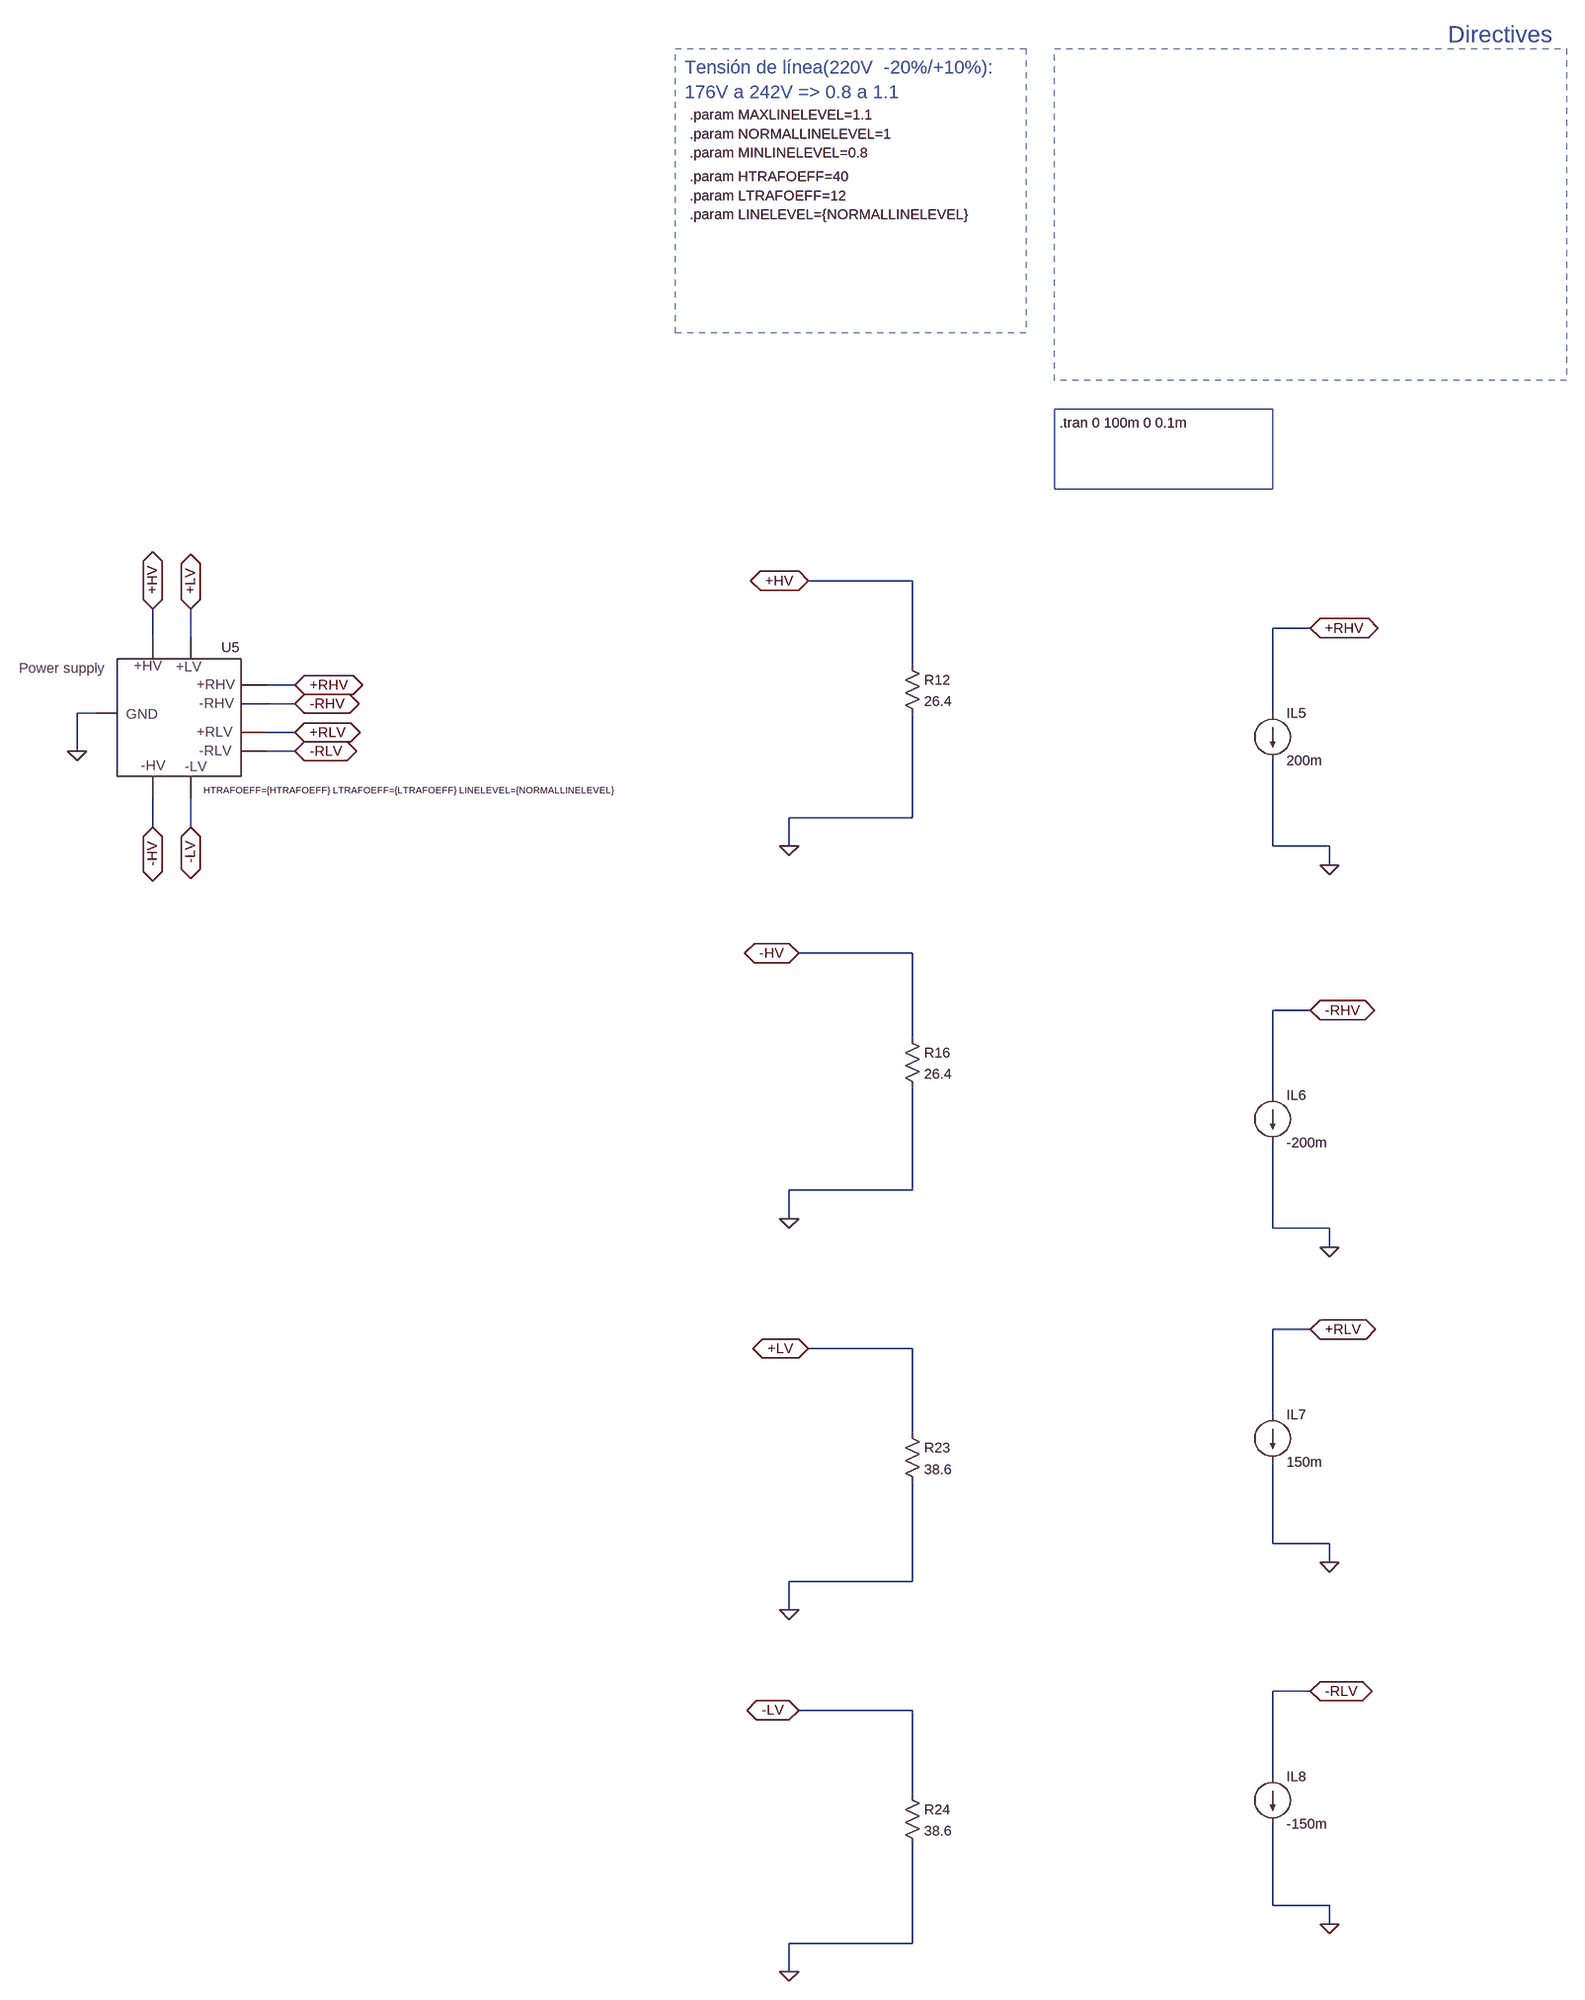
[diagram p0: schematic power_supply_V_1.0.asc]
power_supply_V_1.0.asc, the LTspice schematic file:
Version 4
SHEET 1 5728 3316
WIRE 3584 -688 3408 -688
WIRE 4256 -608 4192 -608
WIRE 1920 -592 1920 -640
WIRE 1984 -592 1984 -640
WIRE 3584 -544 3584 -688
WIRE 2160 -512 2112 -512
WIRE 2160 -480 2112 -480
WIRE 1824 -464 1792 -464
WIRE 4192 -464 4192 -608
WIRE 2160 -432 2112 -432
WIRE 1792 -400 1792 -464
WIRE 2160 -400 2112 -400
WIRE 3584 -288 3584 -464
WIRE 3584 -288 3376 -288
WIRE 1920 -272 1920 -320
WIRE 1984 -272 1984 -320
WIRE 3376 -240 3376 -288
WIRE 4192 -240 4192 -384
WIRE 4288 -240 4192 -240
WIRE 4288 -208 4288 -240
WIRE 3584 16 3392 16
WIRE 4256 112 4192 112
WIRE 3584 160 3584 16
WIRE 4192 256 4192 112
WIRE 3584 416 3584 240
WIRE 3584 416 3376 416
WIRE 3376 464 3376 416
WIRE 4192 480 4192 336
WIRE 4288 480 4192 480
WIRE 4288 512 4288 480
WIRE 4256 816 4192 816
WIRE 3584 848 3408 848
WIRE 4192 960 4192 816
WIRE 3584 992 3584 848
WIRE 4192 1184 4192 1040
WIRE 4288 1184 4192 1184
WIRE 4288 1216 4288 1184
WIRE 3584 1248 3584 1072
WIRE 3584 1248 3376 1248
WIRE 3376 1296 3376 1248
WIRE 4256 1520 4192 1520
WIRE 3584 1552 3392 1552
WIRE 4192 1664 4192 1520
WIRE 3584 1696 3584 1552
WIRE 4192 1888 4192 1744
WIRE 4288 1888 4192 1888
WIRE 4288 1920 4288 1888
WIRE 3584 1952 3584 1776
WIRE 3584 1952 3376 1952
WIRE 3376 2000 3376 1952
FLAG 3408 -688 +HV
IOPIN 3408 -688 BiDir
FLAG 3376 -240 0
FLAG 3392 16 -HV
IOPIN 3392 16 BiDir
FLAG 3376 464 0
FLAG 4256 -608 +RHV
IOPIN 4256 -608 BiDir
FLAG 4288 -208 0
FLAG 4256 112 -RHV
IOPIN 4256 112 BiDir
FLAG 4288 512 0
FLAG 4256 816 +RLV
IOPIN 4256 816 BiDir
FLAG 4288 1216 0
FLAG 4256 1520 -RLV
IOPIN 4256 1520 BiDir
FLAG 4288 1920 0
FLAG 3408 848 +LV
IOPIN 3408 848 BiDir
FLAG 3376 1296 0
FLAG 3392 1552 -LV
IOPIN 3392 1552 BiDir
FLAG 3376 2000 0
FLAG 1792 -400 0
FLAG 1920 -640 +HV
IOPIN 1920 -640 BiDir
FLAG 1984 -640 +LV
IOPIN 1984 -640 BiDir
FLAG 1920 -272 -HV
IOPIN 1920 -272 BiDir
FLAG 1984 -272 -LV
IOPIN 1984 -272 BiDir
FLAG 2160 -512 +RHV
IOPIN 2160 -512 BiDir
FLAG 2160 -480 -RHV
IOPIN 2160 -480 BiDir
FLAG 2160 -432 +RLV
IOPIN 2160 -432 BiDir
FLAG 2160 -400 -RLV
IOPIN 2160 -400 BiDir
SYMBOL current 4192 -464 R0
WINDOW 123 0 0 Left 0
WINDOW 39 0 0 Left 0
SYMATTR InstName IL5
SYMATTR Value 200m
SYMBOL current 4192 256 R0
WINDOW 123 0 0 Left 0
WINDOW 39 0 0 Left 0
SYMATTR InstName IL6
SYMATTR Value -200m
SYMBOL current 4192 960 R0
WINDOW 123 0 0 Left 0
WINDOW 39 0 0 Left 0
SYMATTR InstName IL7
SYMATTR Value 150m
SYMBOL current 4192 1664 R0
WINDOW 123 0 0 Left 0
WINDOW 39 0 0 Left 0
SYMATTR InstName IL8
SYMATTR Value -150m
SYMBOL res 3568 -560 R0
SYMATTR InstName R12
SYMATTR Value 26.4
SYMBOL res 3568 144 R0
SYMATTR InstName R16
SYMATTR Value 26.4
SYMBOL res 3568 976 R0
SYMATTR InstName R23
SYMATTR Value 38.6
SYMBOL res 3568 1680 R0
SYMATTR InstName R24
SYMATTR Value 38.6
SYMBOL power_supply_V_1.0_HB 1968 -448 R0
WINDOW 0 68 -127 Left 2
WINDOW 39 38 114 Left 1
SYMATTR InstName U5
SYMATTR SpiceLine HTRAFOEFF={HTRAFOEFF} LTRAFOEFF={LTRAFOEFF} LINELEVEL={NORMALLINELEVEL}
TEXT 3832 -1064 Left 2 !.tran 0 100m 0 0.1m
TEXT 4488 -1720 Left 4 ;Directives
TEXT 3208 -1480 Left 2 !.param HTRAFOEFF=40
TEXT 3208 -1448 Left 2 !.param LTRAFOEFF=12
TEXT 3208 -1416 Left 2 !.param LINELEVEL={NORMALLINELEVEL}
TEXT 3200 -1664 Left 3 ;Tensión de línea(220V  -20%/+10%):\n176V a 242V => 0.8 a 1.1
TEXT 3208 -1584 Left 2 !.param MAXLINELEVEL=1.1
TEXT 3208 -1520 Left 2 !.param MINLINELEVEL=0.8
TEXT 3208 -1552 Left 2 !.param NORMALLINELEVEL=1
RECTANGLE Normal 4688 -1136 3824 -1696 3
RECTANGLE Normal 3776 -1216 3184 -1696 2
RECTANGLE Normal 4192 -928 3824 -1088

The netlist it stands for:
* power_supply_V_1.0.asc
IL5 +RHV 0 200m
IL6 -RHV 0 -200m
IL7 +RLV 0 150m
IL8 -RLV 0 -150m
R12 +HV 0 26.4
R16 -HV 0 26.4
R23 +LV 0 38.6
R24 -LV 0 38.6
XU5 0 +HV +LV +RHV -RHV +RLV -RLV -LV -HV power_supply_V_1.0_HB params: HTRAFOEFF={HTRAFOEFF} LTRAFOEFF={LTRAFOEFF} LINELEVEL={NORMALLINELEVEL}  ; pins GND +HV +LV +RHV -RHV +RLV -RLV -LV -HV
.tran 0 100m 0 0.1m
* Directives
.param HTRAFOEFF=40
.param LTRAFOEFF=12
.param LINELEVEL={NORMALLINELEVEL}
* Tensión de línea(220V  -20%/+10%):
* 176V a 242V => 0.8 a 1.1
.param MAXLINELEVEL=1.1
.param MINLINELEVEL=0.8
.param NORMALLINELEVEL=1
.backanno
.end